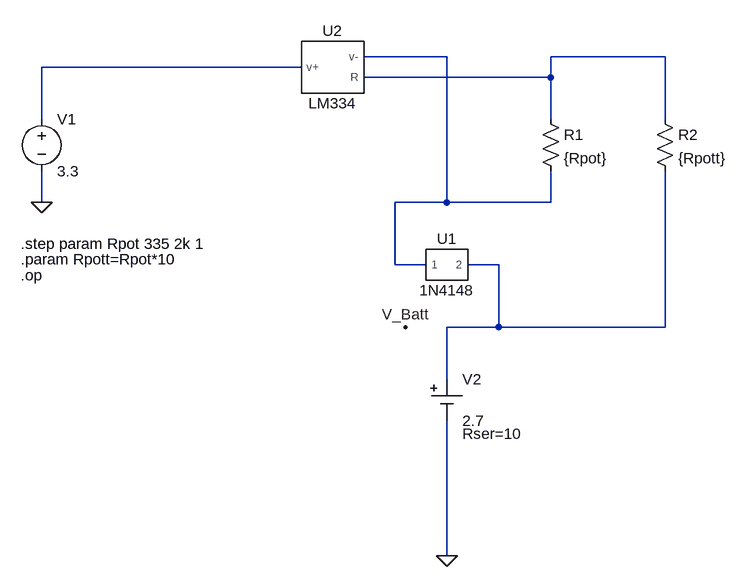
[diagram p0: schematic Current Charging.asc]
Current Charging.asc, the LTspice schematic file:
Version 4
SHEET 1 1072 900
WIRE 368 112 240 112
WIRE 704 112 528 112
WIRE 144 128 -256 128
WIRE 528 144 528 112
WIRE 528 144 240 144
WIRE -256 208 -256 128
WIRE 528 208 528 144
WIRE 704 208 704 112
WIRE -256 336 -256 288
WIRE 368 336 368 112
WIRE 368 336 288 336
WIRE 528 336 528 288
WIRE 528 336 368 336
WIRE 288 432 288 336
WIRE 336 432 288 432
WIRE 448 432 400 432
WIRE 448 528 448 432
WIRE 448 528 368 528
WIRE 704 528 704 288
WIRE 704 528 448 528
WIRE 368 608 368 528
WIRE 368 880 368 672
FLAG -256 336 0
FLAG 304 528 V_Batt
FLAG 368 880 0
SYMBOL res 512 192 R0
SYMATTR InstName R1
SYMATTR Value {Rpot}
SYMBOL res 688 192 R0
SYMATTR InstName R2
SYMATTR Value {Rpott}
SYMBOL voltage -256 192 R0
WINDOW 123 0 0 Left 0
WINDOW 39 0 0 Left 0
SYMATTR InstName V1
SYMATTR Value 3.3
SYMBOL Misc\\cell 368 608 R0
WINDOW 123 0 0 Left 0
WINDOW 39 24 84 Left 2
SYMATTR SpiceLine Rser=10
SYMATTR InstName V2
SYMATTR Value 2.7
SYMBOL 1N4148 368 432 R0
SYMATTR InstName U1
SYMBOL LM334 192 128 R0
SYMATTR InstName U2
TEXT -288 424 Left 2 !.param Rpott=Rpot*10
TEXT -288 448 Left 2 !.op
TEXT -288 400 Left 2 !.step param Rpot 335 2k 1

The netlist it stands for:
* Current Charging.asc
R1 N002 N001 {Rpot}
R2 N002 N004 {Rpott}
V1 N003 0 3.3
V2 N004 0 2.7 Rser=10
XU1 N001 N004 1N4148  ; pins 1 2
XU2 N003 N001 N002 LM334  ; pins v+ v- R
.param Rpott=Rpot*10
.op
.step param Rpot 335 2k 1
.lib C:\Users\KVentayen\OneDrive - California State University Chico\Desktop\Capstone\1N4148.lib
.lib C:\Users\KVentayen\OneDrive - California State University Chico\Desktop\Capstone\lm344.cir
.backanno
.end